# Altium schematic sheet System Voltage Regulators.SchDoc
size A4; Organization: TESLA Motors, INC; Address1: 3500 Deer Creek Road; Address2: Palo Alto, CA; Address4: U.S.A.; SheetNumber: 6; SheetTotal: 21
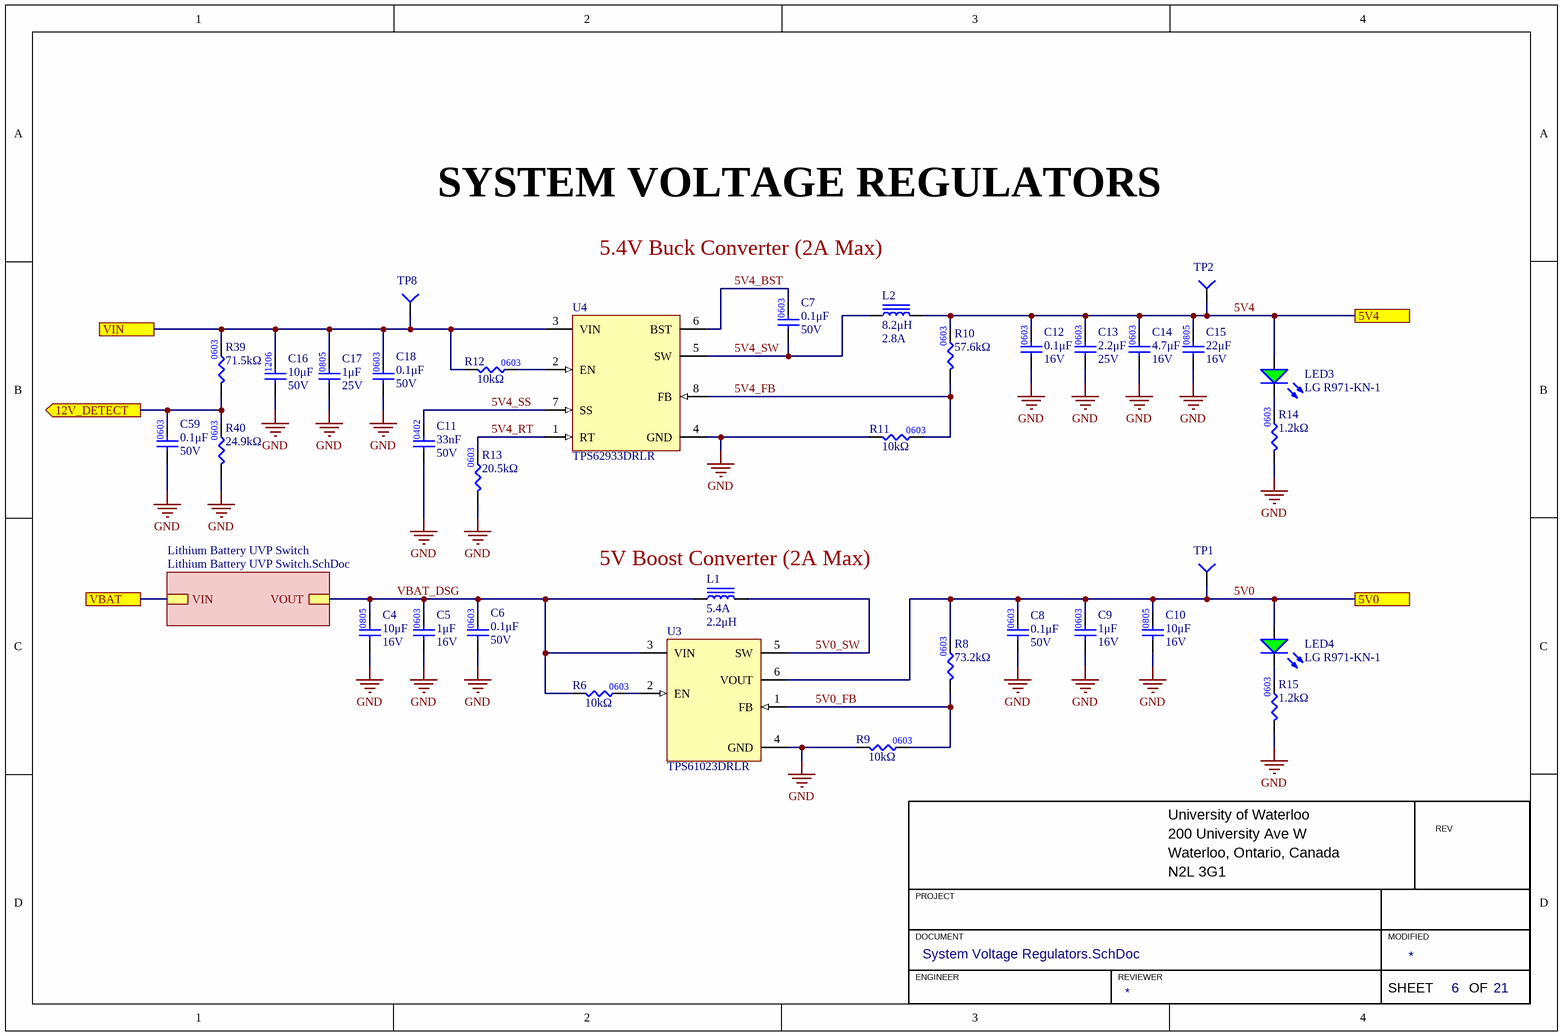
[diagram p0: System Voltage Regulators.SchDoc]

## Parts
C4  value 10μF  Voltage Rating: 16V  [CAP0805]  (hidden comment: CAP_10uF_16V_0805)
C5  value 1μF  Voltage Rating: 16V  [CAP0603]  (hidden comment: CAP_1uF_16V_0603)
C6  value 0.1μF  Voltage Rating: 50V  [CAP0603]  (hidden comment: CAP_0.1uF_50V_0603)
C7  value 0.1μF  Voltage Rating: 50V  [CAP0603]  (hidden comment: CAP_0.1uF_50V_0603)
C8  value 0.1μF  Voltage Rating: 50V  [CAP0603]  (hidden comment: CAP_0.1uF_50V_0603)
C9  value 1μF  Voltage Rating: 16V  [CAP0603]  (hidden comment: CAP_1uF_16V_0603)
C10  value 10μF  Voltage Rating: 16V  [CAP0805]  (hidden comment: CAP_10uF_16V_0805)
C11  Capacitance: 33nF  Rated DC Voltage (URdc): 50V  [CAP0603]  (hidden comment: CAP_0.033uF_50V_X7R_0603)
C12  value 0.1μF  Voltage Rating: 16V  [CAP0603]  (hidden comment: CAP_0.1uF_16V_0603)
C13  value 2.2μF  Voltage Rating: 25V  [CAP0603]  (hidden comment: CAP_2.2uF_25V_0603)
C14  value 4.7μF  Voltage Rating: 16V  [CAP0603]  (hidden comment: CAP_4.7uF_16V_0603)
C15  value 22μF  Voltage Rating: 16V  [CAP0805]  (hidden comment: CAP_22uF_16V_0805)
C16  value 10μF  Voltage Rating: 50V  [CAP1206]  (hidden comment: CAP_10uF_50V_1206)
C17  value 1μF  Voltage Rating: 25V  [CAP0805]  (hidden comment: CAP_1uF_25V_0805)
C18  value 0.1μF  Voltage Rating: 50V  [CAP0603]  (hidden comment: CAP_0.1uF_50V_0603)
C59  value 0.1μF  Voltage Rating: 50V  [CAP0603]  (hidden comment: CAP_0.1uF_50V_0603)
L1  Current Rating: 5.4A  Inductance: 2.2μH  [IND_1210]  (hidden comment: IND_2.2uH_5.4A)
L2  value 8.2μH  Current Rating: 2.8A  [IND_WURTH_1616]  (hidden comment: IND_8.2uH_2.8A)
LED3  Manufacturer Part Number 1: LG R971-KN-1  [LED_0805_GREEN]  (hidden comment: LED_GREEN_0805)
LED4  Manufacturer Part Number 1: LG R971-KN-1  [LED_0805_GREEN]  (hidden comment: LED_GREEN_0805)
R6  value 10kΩ  [RES0603]  (hidden comment: RES_10kΩ_0603_1%)
R8  value 73.2kΩ  [RES0603]  (hidden comment: RES_73.2kΩ_0603_1%)
R9  value 10kΩ  [RES0603]  (hidden comment: RES_10kΩ_0603_1%)
R10  value 57.6kΩ  [RES0603]  (hidden comment: RES_57.6kΩ_0603_1%)
R11  value 10kΩ  [RES0603]  (hidden comment: RES_10kΩ_0603_1%)
R12  value 10kΩ  [RES0603]  (hidden comment: RES_10kΩ_0603_1%)
R13  value 20.5kΩ  [RES0603]  (hidden comment: RES_20.5kΩ_0603_1%)
R14  value 1.2kΩ  [RES0603]  (hidden comment: RES_1.2kΩ_0603_1%)
R15  value 1.2kΩ  [RES0603]  (hidden comment: RES_1.2kΩ_0603_1%)
R39  value 71.5kΩ  [RES0603]  (hidden comment: RES_71.5kΩ_0603_1%)
R40  value 24.9kΩ  [RES0603]  (hidden comment: RES_24.9kΩ_0603_1%)
TP1  TESTPOINT_KEYSTONE_LOOP  [KEYSTONE_5019]  (value not drawn)
TP2  TESTPOINT_KEYSTONE_LOOP  [KEYSTONE_5019]  (value not drawn)
TP8  TESTPOINT_KEYSTONE_LOOP  [KEYSTONE_5019]  (value not drawn)
U3  TPS61023DRLR  [TI_SOT-563]
U4  TPS62933DRLR  [TI_SOT-583]

## Sub-sheets
Lithium Battery UVP Switch = Lithium Battery UVP Switch.SchDoc: VIN, VOUT

## Ports
5V0, 5V4, 12V_DETECT (out), VBAT, VIN

## Nets
GND: C4.1 C5.1 C6.1 C8.1 C9.1 C10.1 C11.1 C12.1 C13.1 C14.1 C15.1 C16.1 C17.1 C18.1 C59.1 R9.1 R11.1 R13.1 R14.1 R15.1 R40.1 U3.4(GND) U4.4(GND)
5V0: C8.2 C9.2 C10.2 LED4.1(A) R8.2 TP1.1(=value) U3.6(VOUT) ; port 5V0
5V0_FB: R8.1 R9.2 U3.1(FB)
5V0_SW: L1.2 U3.5(SW)
5V4: C12.2 C13.2 C14.2 C15.2 L2.2 LED3.1(A) R10.2 TP2.1(=value) ; port 5V4
5V4_BST: C7.2 U4.6(BST)
5V4_FB: R10.1 R11.2 U4.8(FB)
5V4_RT: R13.2 U4.1(RT)
5V4_SS: C11.2 U4.7(SS)
5V4_SW: C7.1 L2.1 U4.5(SW)
12V_DETECT: C59.2 R39.1 R40.2 ; port 12V_DETECT
VBAT: port VBAT, sheet Lithium Battery UVP Switch/VIN
VBAT_DSG: C4.2 C5.2 C6.2 L1.1 R6.1 U3.3(VIN) ; sheet Lithium Battery UVP Switch/VOUT
VIN: C16.2 C17.2 C18.2 R12.1 R39.2 TP8.1(=value) U4.3(VIN) ; port VIN
NetLED3_2: LED3.2(K) R14.2
NetLED4_2: LED4.2(K) R15.2
NetR6_2: R6.2 U3.2(EN)
NetR12_2: R12.2 U4.2(EN)

## Notes on the sheet
- SYSTEM VOLTAGE REGULATORS
- 5.4V Buck Converter (2A Max)
- (near L1) 5V Boost Converter (2A Max)
- University of Waterloo
- 200 University Ave W
- REV
- PROJECT
- Waterloo, Ontario, Canada
- N2L 3G1
- DOCUMENT
- ENGINEER
- REVIEWER
- MODIFIED
- SHEET
- OF
- (in symbol CAP_0.033uF_50V_X7R_0603) 0402
- (in symbol CAP_1uF_25V_0805) 0805
- (in symbol CAP_2.2uF_25V_0603) 0603
- (in symbol RES_20.5kΩ_0603_1%) 0603
- (in symbol RES_24.9kΩ_0603_1%) 0603
- (in symbol RES_73.2kΩ_0603_1%) 0603

## Library data of the parts
C4 C10 = CAP_10uF_16V_0805: CAP CER 10UF 16V X5R 0805; Manufacturer 1: Yageo; Manufacturer Part Number 1: CC0805KKX5R7BB106; Package/Footprint: 0805; Supplier 1: Digi-Key; Supplier Part Number 1: 311-1865-1-ND; Mounting Type: SMD; Dielectric: X5R
C5 C9 = CAP_1uF_16V_0603: CAP CER 1UF 16V X7R 0603; Manufacturer 1: Yageo; Manufacturer Part Number 1: CC0603KPX7R7BB105; Supplier 1: Digi-Key; Supplier Part Number 1: 13-CC0603KPX7R7BB105CT-ND; Dielectric: X7R; Mounting Type: SMD; Package: 0603
C6 C7 C18 C59 = CAP_0.1uF_50V_0603: CAP CER 0.1UF 50V X7R 0603; Manufacturer 1: Yageo; Manufacturer Part Number 1: CC0603KRX7R9BB104; Package/Footprint: 0603; Supplier 1: Digi-Key; Supplier Part Number 1: 311-1344-1-ND; Mounting Type: SMD; Dielectric: X7R
C8 = CAP_0.1uF_50V_0603: CAP CER 0.1UF 50V X7R 0603; Manufacturer Part Number 1: CC0603KRX7R9BB104; Manufacturer 1: Yageo; Package/Footprint: 0603; Supplier Part Number 1: 311-1344-1-ND; Supplier 1: Digi-Key; Dielectric: X7R; Mounting Type: SMD
C11 = CAP_0.033uF_50V_X7R_0603: CAP CER 0.033UF 50V X7R 0603; Manufacturer: Samsung Electro-Mechanics; Manufacturer Part Number: CL10B333KB8NFNC; Supplier 1: Digi-Key; Supplier Part Number 1: 1276-2040-1-ND; Mounting Type: Surface Mount; Temperature Characteristics Code: X7R; Package: 0603
C12 = CAP_0.1uF_16V_0603: CAP CER 0.1UF 16V X7R 0603; Manufacturer Part Number 1: CC0603KRX7R7BB104; Manufacturer 1: Yageo; Package: 0603; Supplier Part Number 1: 311-1088-1-ND; Supplier 1: Digi-Key; Dielectric: X7R
C13 = CAP_2.2uF_25V_0603: CAP CER 2.2UF 25V X5R 0603; Manufacturer 1: TDK Corporation; Manufacturer Part Number 1: C1608X5R1E225K080AB; Dielectric: 5; Supplier Part Number 1: 445-5964-1-ND; Supplier 1: Digi-Key
C14 = CAP_4.7uF_16V_0603: CAP CER 4.7UF 16V X6S 0603; Manufacturer Part Number 1: GRM188C81C475KE11D; Manufacturer 1: Murata Electronics; Supplier Part Number 1: 490-13362-1-ND; Supplier 1: Digi-Key; Mounting Type: SMD; Package: 0603; Dielectric: X6S
C15 = CAP_22uF_16V_0805: CAP CER 22UF 16V X5R 0805; Manufacturer 1: Murata Electronics; Manufacturer Part Number 1: GRM219R61C226ME15L; Package/Footprint: 0805; Mounting Type: SMD; Supplier 1: Digi-Key; Supplier Part Number 1: 490-9952-1-ND; Dielectric: X5R
C16 = CAP_10uF_50V_1206: CAP CER 10UF 50V X5R 1206; Manufacturer 1: Murata; Manufacturer Part Number 1: GRT31CR61H106KE01L; Supplier Part Number 1: 490-12456-1-ND; Supplier 1: Digi-Key; Mounting Type: SMD; Package: 1206; Dielectric: X5R
C17 = CAP_1uF_25V_0805: CAP CER 1UF 25V X7R 0805; Manufacturer 1: Murata; Manufacturer Part Number 1: GCM21BR71E105KA56L; Supplier 1: Digi-Key; Supplier Part Number 1: 490-4785-1-ND; Dielectric: X7R
L1 = IND_2.2uH_5.4A: FIXED IND 2.2UH 5.4A 46MOHM SMD; Manufacturer 1: Vishay Dale; Manufacturer Part Number 1: IHLP1210BZEZ2R2M5A; Supplier 1: Digi-Key; Mounting Type: SMD; DC Resistance (DCR): 46mOhm; Supplier Part Number 1: 541-IHLP1210BZEZ2R2M5ACT-ND
L2 = IND_8.2uH_2.8A: FIXED IND 8.2UH 2.8A 86 MOHM SMD; Manufacturer 1: Würth Elektronik; Manufacturer Part Number 1: 74438357082; Supplier Part Number 1: 732-11205-1-ND; Supplier 1: Digi-Key; Mounting Type: SMD; Package/Footprint: SMD
LED3 LED4 = LED_GREEN_0805: LED GREEN DIFFUSED 0805 SMD; Manufacturer 1: OSRAM; Forward Voltage Drop: 2.2V; Package/Footprint: 0805; Supplier Part Number 1: 475-1410-1-ND; Supplier 1: Digi-Key; Mounting Type: SMD
R6 R9 R11 R12 = RES_10kΩ_0603_1%: RES 10K OHM 1% 1/8W 0603; Manufacturer 1: Stackpole Electronics Inc; Manufacturer Part Number 1: RNCP0603FTD10K0; Supplier Part Number 1: RNCP0603FTD10K0CT-ND; Supplier 1: Digi-Key; Mounting Type: SMD; Package: 0603
R8 = RES_73.2kΩ_0603_1%: RES 73.2K OHM 1% 1/16W 0603; Manufacturer 1: TE Connectivity Passive Product; Manufacturer Part Number 1: CPF0603F73K2C1; Supplier Part Number 1: A102314CT-ND; Supplier 1: Digi-Key
R10 = RES_57.6kΩ_0603_1%: RES 57.6K OHM 1% 1/10W 0603; Manufacturer 1: YAGEO; Manufacturer Part Number 1: RC0603FR-0757K6L; Package/Footprint: 0603; Supplier 1: Digi-Key; Supplier Part Number 1: 311-57.6KHRCT-ND
R13 = RES_20.5kΩ_0603_1%: RES SMD 20.5K OHM 1% 1/10W 0603; Manufacturer 1: Panasonic Electronic Components; Manufacturer Part Number 1: ERJ-3EKF2052V; Supplier 1: Digikey; Supplier Part Number 1: P2.05KHCT-ND
R14 R15 = RES_1.2kΩ_0603_1%: RES 1.2K OHM 1% 1/10W 0603; Manufacturer 1: Yageo; Manufacturer Part Number 1: RC0603FR-071K2L; Supplier Part Number 1: 311-1.20KHRCT-ND; Supplier 1: Digi-Key; Package: 0603
R39 = RES_71.5kΩ_0603_1%: RES 71.5K OHM 1% 1/10W 0603; Manufacturer 1: Stackpole Electronics Inc; Manufacturer Part Number 1: RMCF0603FT71K5; Package/Footprint: 0603; Mounting Type: SMD; Supplier 1: Digi-Key; Supplier Part Number 1: RMCF0603FT71K5CT-ND
R40 = RES_24.9kΩ_0603_1%: RES 24.9K OHM 1% 1/10W 0603; Manufacturer 1: YAGEO; Manufacturer Part Number 1: RC0603FR-0724K9L; Supplier Part Number 1: 311-24.9KHRCT-ND; Supplier 1: Digi-Key
TP1 TP2 TP8 = TESTPOINT_KEYSTONE_LOOP: PC TEST POINT MINIATURE; Manufacturer 1: Keystone Electronics; Manufacturer Part Number 1: 5019; Package/Footprint: SMD; Supplier 1: Digi-Key; Mounting Type: SMD; Supplier Part Number 1: 36-5019CT-ND
U3 = TPS61023DRLR: IC REG BOOST ADJ 3A SOT563; Manufacturer 1: Texas Instruments; Package/Footprint: SOT-563; Manufacturer Part Number 1: TPS61023DRLR; Supplier 1: Digikey; Supplier Part Number 1: 296-TPS61023DRLRCT-ND
U4 = TPS62933DRLR: IC REG BUCK ADJ 3A SOT583; Manufacturer 1: Texas Instruments; Package/Footprint: SOT-583; Manufacturer Part Number 1: TPS62933DRLR; Supplier 1: Digikey; Supplier Part Number 1: 296-TPS62933DRLRCT-ND